# Altium schematic sheet USBDAC.SchDoc
size A3
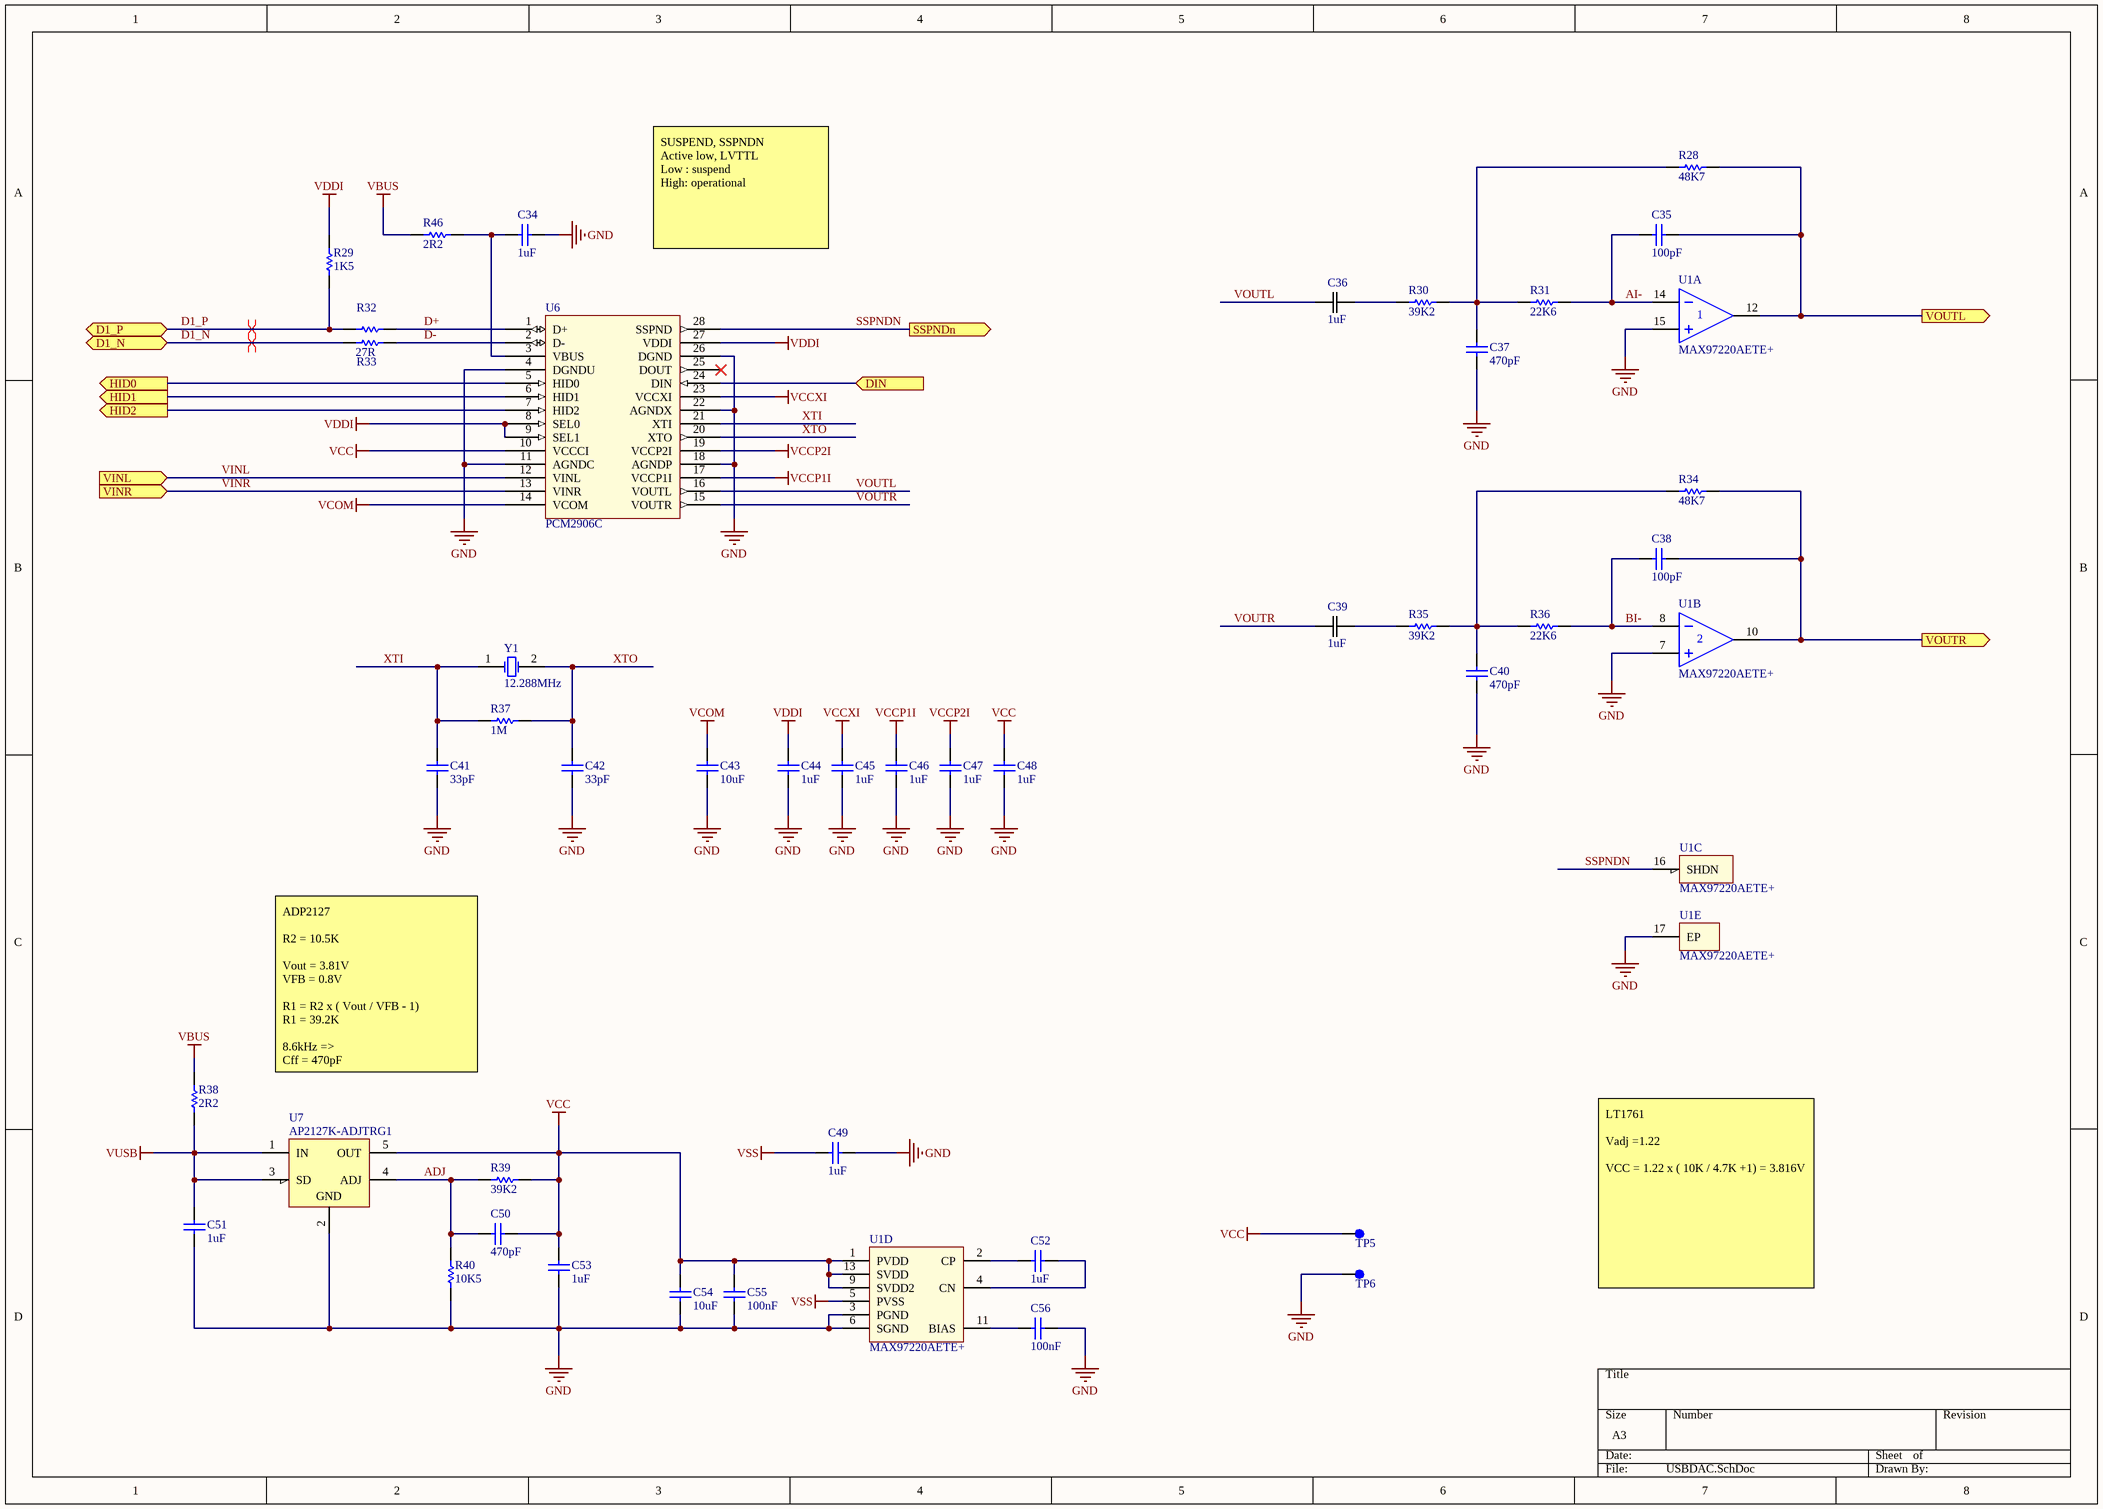
[diagram p0: USBDAC.SchDoc]

## Parts
C34  value 1uF  [CAPC0402(1005)33_L]  (hidden comment: GRM155R61C105KA12D)
C35  value 100pF  [CAPC0402(1005)33_L]  (hidden comment: 0402CG101J500NT)
C36  1uF  [CAP_ECPU_G2]
C37  value 470pF  [CAPC0402(1005)33_L]  (hidden comment: GRM1555C1H471JA01D)
C38  value 100pF  [CAPC0402(1005)33_L]  (hidden comment: 0402CG101J500NT)
C39  1uF  [CAP_ECPU_G2]
C40  value 470pF  [CAPC0402(1005)33_L]  (hidden comment: GRM1555C1H471JA01D)
C41  value 33pF  [CAPC0402(1005)33_L]  (hidden comment: CC0402JRNPO9BN330)
C42  value 33pF  [CAPC0402(1005)33_L]  (hidden comment: CC0402JRNPO9BN330)
C43  value 10uF  [CAPC0603(1608)55_L]  (hidden comment: CL10A106MQ8NNNC)
C44  value 1uF  [CAPC0402(1005)33_L]  (hidden comment: GRM155R61C105KA12D)
C45  value 1uF  [CAPC0402(1005)33_L]  (hidden comment: GRM155R61C105KA12D)
C46  value 1uF  [CAPC0402(1005)33_L]  (hidden comment: GRM155R61C105KA12D)
C47  value 1uF  [CAPC0402(1005)33_L]  (hidden comment: GRM155R61C105KA12D)
C48  value 1uF  [CAPC0402(1005)33_L]  (hidden comment: GRM155R61C105KA12D)
C49  value 1uF  [CAPC0402(1005)33_L]  (hidden comment: GRM155R61C105KA12D)
C50  value 470pF  [CAPC0402(1005)33_L]  (hidden comment: GRM1555C1H471JA01D)
C51  value 1uF  [CAPC0402(1005)33_L]  (hidden comment: GRM155R61C105KA12D)
C52  value 1uF  [CAPC0402(1005)33_L]  (hidden comment: GRM155R61C105KA12D)
C53  value 1uF  [CAPC0402(1005)33_L]  (hidden comment: GRM155R61C105KA12D)
C54  value 10uF  [CAPC0603(1608)55_L]  (hidden comment: CL10A106MQ8NNNC)
C55  value 100nF  [CAPC0402(1005)33_L]  (hidden comment: GRM155R61C104KA88D)
C56  value 100nF  [CAPC0402(1005)33_L]  (hidden comment: GRM155R61C104KA88D)
R28  48K7  [RESC0402(1005)_L]
R29  1K5  [RESC0805(2012)_L]
R30  39K2  [RESC0402(1005)_L]
R31  22K6  [RESC0402(1005)_L]
R32  27R  [RESC0402(1005)_L]  (value not drawn)
R33  27R  [RESC0402(1005)_L]
R34  48K7  [RESC0402(1005)_L]
R35  39K2  [RESC0402(1005)_L]
R36  22K6  [RESC0402(1005)_L]
R37  1M  [RESC0402(1005)_L]
R38  2R2  [RESC0402(1005)_L]
R39  39K2  [RESC0402(1005)_L]
R40  10K5  [RESC0402(1005)_L]
R46  2R2  [RESC0402(1005)_L]
TP5  MECH_Testpoint  [MECH_TP_39_mil]  (value not drawn)  (no BOM)
TP6  MECH_Testpoint  [MECH_TP_39_mil]  (value not drawn)  (no BOM)
U1  MAX97220AETE+  [21-0136I_T1633-4]  (parts A,B,C,D,E of 5)
U6  PCM2906C  [SSOP28_N]
U7  AP2127K-ADJTRG1  [DCK0005A_L]
Y1  value 12.288MHz  [XTAL_SMD_5.0x3.2]  (hidden comment: ABM3-12.288MHZ-D2Y-T)

## Ports
D1_N (bidir), D1_P (bidir), DIN (in), HID0 (out), HID1 (out), HID2 (out), SSPNDn (out), VINL (in), VINR (in), VOUTL (out), VOUTR (out)

## Nets
GND: C34.1 C37.1 C40.1 C41.1 C42.1 C43.1 C44.1 C45.1 C46.1 C47.1 C48.1 C49.1 C51.1 C53.1 C54.1 C55.1 C56.2 R40.1 TP6.1(Pin1) U1.3(PGND) U1.6(SGND) U1.7(IN2+) U1.15(IN1+) U1.17(EP) U6.4(DGNDU) U6.11(AGNDC) U6.18(AGNDP) U6.22(AGNDX) U6.26(DGND) U7.2(GND)
VBUS: R38.2 R46.2
VCC: C48.2 C50.2 C53.2 C54.2 C55.2 R39.2 TP5.1(Pin1) U1.1(PVDD) U1.9(SVDD2) U1.13(SVDD) U6.10(VCCCI) U7.5(OUT)
VCCP1I: C46.2 U6.17(VCCP1I)
VCCP2I: C47.2 U6.19(VCCP2I)
VCCXI: C45.2 U6.23(VCCXI)
VCOM: C43.2 U6.14(VCOM)
VDDI: C44.2 R29.2 U6.8(SEL0) U6.9(SEL1) U6.27(VDDI)
VSS: C49.2 U1.5(PVSS)
VUSB: C51.2 R38.1 U7.1(IN) U7.3(SD)
ADJ: C50.1 R39.1 R40.2 U7.4(ADJ)
AI-: C35.1 R31.2 U1.14(IN1-)
BI-: C38.1 R36.2 U1.8(IN2-)
D1_N: R33.1 ; port D1_N
D1_P: R29.1 R32.1 ; port D1_P
D+: R32.2 U6.1(D+)
D-: R33.2 U6.2(D-)
DIN: U6.24(DIN) ; port DIN
HID0: U6.5(HID0) ; port HID0
HID1: U6.6(HID1) ; port HID1
HID2: U6.7(HID2) ; port HID2
SSPNDN: U1.16(SHDN) U6.28(SSPND) ; port SSPNDn
VINL: U6.12(VINL) ; port VINL
VINR: U6.13(VINR) ; port VINR
VOUTL: C36.1 U6.16(VOUTL)
VOUTL: C35.2 R28.2 U1.12(OUT1) ; port VOUTL  [a separate net that carries the same name]
VOUTR: C39.1 U6.15(VOUTR)
VOUTR: C38.2 R34.2 U1.10(OUT2) ; port VOUTR  [a separate net that carries the same name]
XTI: C41.2 R37.1 U6.21(XTI) Y1.1(OSC1)
XTO: C42.2 R37.2 U6.20(XTO) Y1.2(OSC2)
NetC34_2: C34.2 R46.1 U6.3(VBUS)
NetC36_2: C36.2 R30.1
NetC37_2: C37.2 R28.1 R30.2 R31.1
NetC39_2: C39.2 R35.1
NetC40_2: C40.2 R34.1 R35.2 R36.1
NetC52_1: C52.1 U1.4(CN)
NetC52_2: C52.2 U1.2(CP)
NetC56_1: C56.1 U1.11(BIAS)

Not connected (* = marked no-connect by the designer): U6 25(DOUT)*

## Layout directives
differential pair: D1_N, D1_P

## Notes on the sheet
- SUSPEND, SSPNDN
  Active low, LVTTL
  Low : suspend
  High: operational
- ADP2127
  R2 = 10.5K
  Vout = 3.81V
  VFB = 0.8V
  R1 = R2 x ( Vout / VFB - 1)
  R1 = 39.2K
  8.6kHz =>
  Cff = 470pF
- LT1761
  Vadj =1.22
  VCC = 1.22 x ( 10K / 4.7K +1) = 3.816V

## Library data of the parts
C34 C44-C49 C51-C53 = CAP_1uF_0402: 0402 1μF ±10% 16V X5R; Voltage: 10V; PackageReference: 0402; MPN: GRM155R61C105KA12D; Dielectric: X5R
C35 C38 = CAP_100pF_0402: 0402 100pF ±5% 50V C0G，NP0; Dielectric: C0G; PackageReference: 0402; MPN: 0402CG101J500NT; Voltage: 50V
C36 C39 = CAP-ECP-U1C105MA5: 1µF Film Capacitor  16V Acrylic, Metallized - Stacked 1210 (3225 Metric); Vendor: Panasonic; Built_By: EMA_UL_Team; Type: DEV; C: Copyright (C) 2015 Accelerated Designs. All rights reserved; MPN: ECP-U1C105MA5; RefDes: RefDes; Value: 1uF
C37 C40 C50 = CAP_470pF_0402: 0402 470pF ±5% 50V C0G; PackageReference: 0402; MPN: GRM1555C1H471JA01D; Voltage: 50V; Dielectric: C0G
C41 C42 = CAP_33pF_0402: 0402 33PF ±5% 50V NPO; Dielectric: C0G; PackageReference: 0402; MPN: CC0402JRNPO9BN330; Voltage: 50V
C43 C54 = CAP_10uF_0603: 0603 10uF ±20% 6.3V X5R H=0.8mm; Voltage: 10V; PackageReference: 0603; MPN: CL10A106MQ8NNNC; Dielectric: X5R
C55 C56 = CAP_100nF_0402: 0402 100nF ±10% 16V X5R; PackageReference: 0402; MPN: GRM155R61C104KA88D; Voltage: 16V; Dielectric: X5R
R28 R34 = RES_48K7_0402: 0402 48.7KΩ ±1% 1/16W; MPN: 0402WGF4872TCE; Power: 62.5mW; Tolerance: 1%; Value: 48K7
R29 = RES_1K5_0805: 0805 1.5KΩ ±5% 1/8W; MPN: RC0805JR-071K5L; Power: 125mW; Tolerance: 5%; Value: 1K5
R30 R35 R39 = RES_39K2_0402: 0402 39.2KΩ ±1% 1/16W; MPN: RC0402FR-0739K2L; Power: 62.5mW; Tolerance: 1%; Value: 39K2
R31 R36 = RES_22K6_0402: 0402 22.6KΩ ±1% 1/16W; MPN: RC0402FR-0722K6L; Power: 62.5mW; Tolerance: 1%; Value: 22K6
R32 R33 = RES_27R_0402: 0402 27Ω ±1% 1/16W; MPN: RC0402FR-0727RL; Power: 62.5mW; Tolerance: 1%; Value: 27R
R37 = RES_1M_0402: 0402 1MΩ ±1% 1/16W; MPN: RC0402FR-071ML; Power: 62.5mW; Tolerance: 1%; Value: 1M
R38 R46 = RES_2R2_0402: 0402 2.2Ω ±1% 1/16W; MPN: 0402WGF220KTCE; Power: 62.5mW; Tolerance: 1%; Value: 2R2
R40 = RES_10K5_0402: 0402 10.5KΩ ±1% 1/16W; MPN: RC0402FR-0710K5L; Power: 62.5mW; Tolerance: 1%; Value: 10K5
TP5 TP6 = MECH_Testpoint: Testpoint
U1 = MAX97220AETE+: Differential Input DirectDrive Line Drivers/Headphone Amplifiers; MPN: MAX97220AETE+T; Farnell: 2516953; DigiKey: MAX97220AETE+TCT-ND
U6 = IC-AUDIO-PCM2906C: IC STEREO AUD CODEC W/USB 28SSOP; MPN: PCM2906CDB
U7 = AP2127K-ADJTRG1: 300mA HIGH SPEED, EXTREMELY LOW NOISE CMOS LDO REGULATOR; Manufacturer: Diodes Inc; Vin(Max)(V): 5.5; Iq(Typ)(mA): 0.06; Vdo(Typ)(mV): 170; Vout Adj(Min)(V): 0.8; Eco-Plan: Green (RoHS & no Sb/Br); Accuracy(%): 2; Iout(Max)(A): 0.3; Vout Adj(Max)(V): 5.0; Vin(Min)(V): 2.5; SubFamily: Single Channel LDO; PackageVersion: 4093553-3/G; Code_JEDEC: MO-203; ComponentLink2Description: Datasheet; ComponentLink1URL: http://www.ti.com/; ComponentLink3Description: Package Specification; ComponentLink2URL: http://www.ti.com/general/docs/lit/getliterature.tsp?genericPartNumber=TPS71701&fileType=pdf; MPN: AP2127K-ADJTRG1; Mounting Technology: Surface Mount; ComponentLink1Description: Manufacturer URL; ComponentLink3URL: http://www.ti.com/litv/pdf/mpds025f; PackageDescription: 5-Pin Plastic Small-Outline, Body 2 x 1.25 mm, Pitch 0.65 mm; PackageReference: DCK0005A
Y1 = XTAL_12.288MHz_ABM3-12.288MHZ-D2Y-T: CRYSTAL 12.288MHZ 18PF SMD; Farnell: 1368769; MPN: ABM3-12.288MHZ-D2Y-T; DigiKey: 535-10635-1-ND